# Altium schematic sheet 06-Key.SchDoc
size A4; DocumentNumber: 27; SheetNumber: 27; SheetTotal: 34
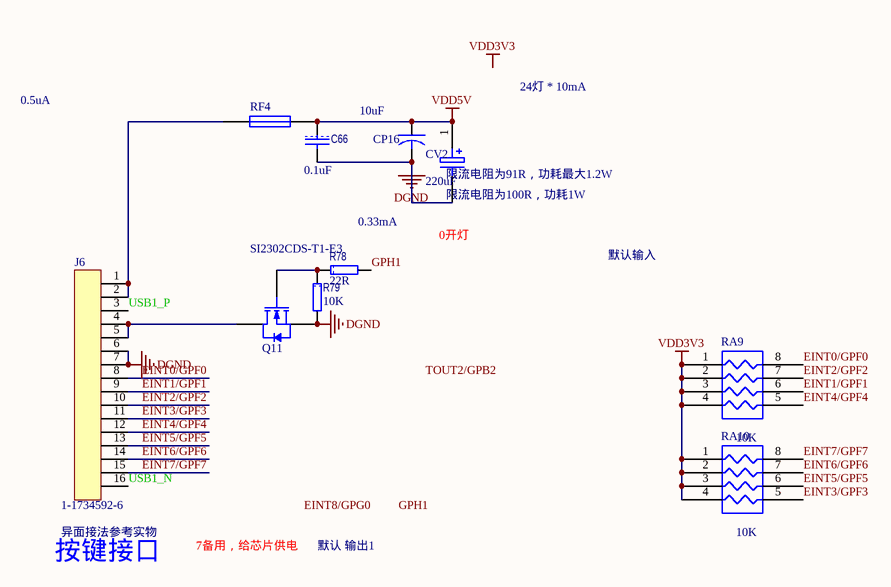
[diagram p0: 06-Key.SchDoc]

## Parts
C66  value 0.1uF  [1608[0603]C]  (hidden comment: C1608X7R1H104K)
CP16  value 10uF  [3216[1206]CB]  (hidden comment: TAJA106K016RNJ)
CV2  value 220uF  [CAPPR5-10x20/H1.1]  (hidden comment: EEU-FM1V221)
J6  1-1734592-6  [FFC/SM0.5-2H16]
Q11  SI2302CDS-T1-E3  [SOT23_N]
R78  value 22R  [1608[0603]R]  (hidden comment: CRCW060322R0FKEA)
R79  value 10K  [1608[0603]R]  (hidden comment: CRCW060310K0FKEA)
RA9  value 10K  [R-AR4]  (hidden comment: CRA06S08310K0JTA)
RA10  value 10K  [R-AR4]  (hidden comment: CRA06S08310K0JTA)
RF4  0805L050WR  [2012[0805]F]  (value not drawn)

## Nets
DGND: C66.2 CP16.2 CV2.2 J6.6 J6.7 Q11.2(S) R79.2
VDD3V3: RA9.1(R1) RA9.2(R2) RA9.3(R3) RA9.4(R4) RA10.1(R1) RA10.2(R2) RA10.3(R3) RA10.4(R4)
VDD5V: C66.1 CP16.1 CV2.1 RF4.2
EINT0/GPF0: J6.8 RA9.8(R1)
EINT1/GPF1: J6.9 RA9.6(R3)
EINT2/GPF2: J6.10 RA9.7(R2)
EINT3/GPF3: J6.11 RA10.5(R4)
EINT4/GPF4: J6.12 RA9.5(R4)
EINT5/GPF5: J6.13 RA10.6(R3)
EINT6/GPF6: J6.14 RA10.7(R2)
EINT7/GPF7: J6.15 RA10.8(R1)
GPH1: R78.2
USB1_N: J6.16
USB1_P: J6.3
NetJ6_1: J6.1 J6.2 RF4.1
NetJ6_4: J6.4 J6.5 Q11.3(D)
NetQ11_1: Q11.1(G) R78.1 R79.1

## Notes on the sheet
- 0.5uA
- 24灯 * 10mA
- (near CV2) 限流电阻为91R，功耗最大1.2W
- (near CV2) 限流电阻为100R，功耗1W
- (near R78) 0.33mA
- 0开灯
- 默认输入
- (near J6) 异面接法参考实物
- 7备用，给芯片供电
- 默认 输出1
- (near J6) 按键接口
- Labels drawn without touching a wire or pin: EINT8/GPG0, GPH1, TOUT2/GPB2, VDD3V3

## Library data of the parts
C66 = CAP: 多层陶瓷电容器MLCC - SMD/SMT 0603 0.1uF 50volts X7R 10%; Manufacturer: TDK; 产品: General Type MLCCs; 产品种类: Low & Medium Capacitance SMD Ceramic Chip Capacitors; 外壳代码 - in: 0603; 外壳代码 - mm: 1608; 封装 / 箱体: 0603 (1608 metric); 封装: Reel; 尺寸: 0.8 mm W x 1.6 mm L x 0.8 mm H; 工作温度范围: - 55 C to + 125 C; 标准包装数量: 4000; 电压额定值: 50 V; 电容-nF: 100 nF; 电容-pF: 100000 pF; 系列: C; Category: 多层陶瓷电容器MLCC - SMD/SMT; ComponentLink1Description: http://www.tdk.com/pdf/general_B11.pdf; ComponentLink1URL: http://www.tdk.com/pdf/general_B11.pdf; Description 1: 多层陶瓷电容器MLCC - SMD/SMT 0603 0.1uF 50volts X7R 10%; Manufacturer Part Number: C1608X7R1H104K; Minimum Order Quantity: 1; Pricing 1: 1=0.160, 50=0.070, 100=0.036, 500=0.019, 1000=0.013, 4000=0.010, 8000=0.009, 12000=0.008, 20000=0.007 (USD); Reeling: True; RoHS - 贸泽: Y; RoHS: RoHS Compliant; Stock 1: 224604; Supplier 1: Mouser; Supplier Part Number 1: 810-C1608X7R1H104K; 制造商: TDK; 容差: 10 %; 温度系数/代码: X7R; 电容: 0.1 uF; 端接类型: SMD/SMT
CP16 = CAPACITOR: 钽质电容器-固体SMD 16volts 10uF 10%; Manufacturer: AVX; ESR: 3 Ohms; 产品: Tantalum Solid Standard Grade - Other Various; 产品种类: SMD Tantalum Capacitors; 制造商库存号: A Case; 外壳代码 - in: 1206; 外壳代码 - mm: 3216; 封装 / 箱体: 1206 (3216 metric); 封装: Reel; 尺寸: 1.6 mm W x 3.2 mm L; 工作温度范围: - 55 C to + 125 C; 损耗因数 DF: 8; 标准包装数量: 2000; 漏泄电流: 1.6 uA; 电压额定值: 16 V; 端接类型: SMD/SMT; 系列: TAJ; 高度: 1.8 mm; Category: 钽质电容器-固体SMD; ComponentLink1Description: http://www.avx.com/docs/Catalogs/taj.pdf; ComponentLink1URL: http://www.avx.com/docs/Catalogs/taj.pdf; Description 1: 钽质电容器-固体SMD 16volts 10uF 10%; Manufacturer Part Number: TAJA106K016RNJ; Minimum Order Quantity: 1; Pricing 1: 1=0.600, 100=0.280, 200=0.250, 500=0.221, 1000=0.200, 2000=0.140, 5000=0.131, 10000=0.124, 25000=0.103 (USD); Reeling: True; RoHS - 贸泽: Y; RoHS: RoHS Compliant; Stock 1: 20335; Supplier 1: Mouser; Supplier Part Number 1: 581-TAJA106K016R; 制造商: AVX; 容差: 10 %; 电容: 10 uF
CV2 = ELECTRO1: 插针 铝质电解电容器 - 带引线 220UF 35V ELECT FM RADIAL; Manufacturer: Panasonic Electronic Components; Manufacturer Part Number: EEU-FM1V471; Description 1: 铝质电解电容器 - 带引线 470UF 35V ELECT FM RADIAL; 电容: 470 uF; 工作温度范围: - 40 C to + 105 C; 封装: Bulk; 产品: General Purpose Electrolytic Capacitors; 容差: 20 %; 外壳直径: 10 mm; 外壳长度: 20 mm; 引线间隔: 5 mm; 制造商: Panasonic; 标准包装数量: 200; Supplier 1: Mouser; Supplier Part Number 1: 667-EEU-FM1V471; RoHS: RoHS Compliant; Category: 铝质电解电容器 - 带引线; Stock 1: 8429; Pricing 1: 1=0.300, 25=0.281, 100=0.258, 250=0.238, 500=0.230, 1000=0.226, 2000=0.216, 5000=0.200 (USD); 系列: FM; 端接类型: Radial; 电压额定值: 35 V; RoHS - 贸泽: Y; Minimum Order Quantity: 1; Reeling: False; ComponentLink1URL: http://www.mouser.com/ds/2/315/ABA0000CE108-5973.pdf; ComponentLink1Description: http://www.mouser.com/ds/2/315/ABA0000CE108-5973.pdf
J6 = 16PIN: TE CONNECTIVITY / AMP - 1-1734592-6 - FFC/FPC CONNECTOR, RECEPTACLE 16POS 1ROW; Pitch Spacing: 0.5; No. of Contacts: 16; No. of Rows: 1; FFC / FPC Thickness: 0.3; Contact Termination: Surface Mount Right Angle; Supplier 1: Newark; Supplier Part Number 1: 16R9533; Manufacturer: TE CONNECTIVITY / AMP; Manufacturer Part Number: 1-1734592-6; RoHS: YES; Description 1: TE CONNECTIVITY / AMP - 1-1734592-6 - FFC/FPC CONNECTOR, RECEPTACLE 16POS 1ROW; Stock 1: 219; Pricing 1: 1=0.383, 25=0.383, 50=0.383, 100=0.328, 500=0.328, 1000=0.328, 2500=0.297 (USD); Series: -; Gender: Receptacle; Contact Plating: Gold; ComponentLink1URL: http://www.tycoelectronics.com/commerce/DocumentDelivery/DDEController?Action=srchrtrv&DocNm=1-1773440-6&DocType=Data+Sheet&DocLang=English; ComponentLink1Description: http://www.tycoelectronics.com/commerce/DocumentDelivery/DDEController?Action=srchrtrv&DocNm=1-1773440-6&DocType=Data+Sheet&DocLang=English; ComponentLink2URL: http://www.farnell.com/cad/1650059.pdf; ComponentLink2Description: http://www.farnell.com/cad/1650059.pdf; ComponentLink3URL: http://www.farnell.com/datasheets/1665333.pdf; ComponentLink3Description: http://www.farnell.com/datasheets/1665333.pdf
Q11 = 2N7002: MOSFET 20V 2.9A 0.86W 57mohm @ 4.5V; Manufacturer: Vishay / Siliconix; 配置: Single; 封装 / 箱体: SOT-23-3; 封装: Reel; 漏极连续电流: 2.6 A; 闸/源击穿电压: +/- 8 V; 安装风格: SMD/SMT; 功率耗散: 710 mW; 电阻汲极/源极 RDS（导通）: 0.057 Ohms; 晶体管极性: N-Channel; 下降时间: 7 ns; 制造商: Vishay; 最大工作温度: + 150 C; 最小工作温度: - 55 C; 产品种类: N-Channel MOSFETs; 标准包装数量: 3000; 典型关闭延迟时间: 30 ns; Supplier 1: Mouser; Supplier Part Number 1: 781-SI2302CDS-E3; Manufacturer Part Number: SI2302CDS-T1-E3; RoHS: RoHS Compliant; Description 1: MOSFET 20V 2.9A 0.86W 57mohm @ 4.5V; Category: MOSFET; Stock 1: 51301; Pricing 1: 1=0.150, 10=0.140, 100=0.130, 250=0.125, 500=0.120, 1000=0.115, 3000=0.110, 6000=0.105, 12000=0.100 (USD); 汲极/源极击穿电压: 20 V; 上升时间: 7 ns; RoHS - 贸泽: Y; Minimum Order Quantity: 1; Reeling: True; ComponentLink1URL: http://www.vishay.com/doc?68645; ComponentLink1Description: http://www.vishay.com/doc?68645
R78 = RES: 厚膜电阻器 - SMD 1/10watt 22ohms 1%; Manufacturer: Vishay / Dale; 尺寸: 0.85 mm W x 1.55 mm L x 0.45 mm H; 工作温度范围: - 55 C to + 155 C; 封装 / 箱体: 0603 (1608 metric); 封装: Reel; 功率额定值: 100 mW; 产品: Thick Film Resistors SMD; 系列: CRCW; 温度系数: 100 PPM / K; 端接类型: SMD/SMT; 电压额定值: 75 V; 制造商: Vishay; 标准包装数量: 5000; 外壳代码 - in: 0603; 外壳代码 - mm: 1608; 产品种类: 0603 Thick Film Chip Resistors; Supplier 1: Mouser; Supplier Part Number 1: 71-CRCW0603-22-E3; Manufacturer Part Number: CRCW060322R0FKEA; RoHS: RoHS Compliant By Exemption; Category: 厚膜电阻器 - SMD; Stock 1: 35802; 电阻: 22 Ohms; 容差: 1 %; Minimum Order Quantity: 1; Reeling: True; ComponentLink1URL: http://www.mouser.com/ds/2/427/dcrcwe3-109170.pdf; ComponentLink1Description: http://www.mouser.com/ds/2/427/dcrcwe3-109170.pdf; Description 1: 厚膜电阻器 - SMD 1/10watt 22ohms 1%; Pricing 1: 1=0.080, 10=0.013, 100=0.010, 1000=0.008, 5000=0.005, 25000=0.004, 50000=0.003 (USD); RoHS - 贸泽: E
R79 = RES: 厚膜电阻器 - SMD 1/10watt 10Kohms 1%; Manufacturer: Vishay / Dale; 尺寸: 0.85 mm W x 1.55 mm L x 0.45 mm H; 工作温度范围: - 55 C to + 155 C; 封装 / 箱体: 0603 (1608 metric); 封装: Reel; 功率额定值: 100 mW; 产品: Thick Film Resistors SMD; 系列: CRCW; 温度系数: 100 PPM / K; 端接类型: SMD/SMT; 电压额定值: 75 V; 制造商: Vishay; 产品种类: 0603 Thick Film Chip Resistors; 标准包装数量: 5000; 外壳代码 - in: 0603; 外壳代码 - mm: 1608; Supplier 1: Mouser; Supplier Part Number 1: 71-CRCW0603-10K-E3; Manufacturer Part Number: CRCW060310K0FKEA; RoHS: RoHS Compliant By Exemption; Category: 厚膜电阻器 - SMD; Stock 1: 0; Pricing 1: 1=0.080, 10=0.013, 100=0.010, 1000=0.008, 5000=0.005, 25000=0.004, 50000=0.003 (USD); 电阻: 10 kOhms; 容差: 1 %; RoHS - 贸泽: E; Minimum Order Quantity: 1; Reeling: True; ComponentLink1URL: http://www.mouser.com/ds/2/427/dcrcwe3-109170.pdf; ComponentLink1Description: http://www.mouser.com/ds/2/427/dcrcwe3-109170.pdf; Description 1: 厚膜电阻器 - SMD 1/10watt 10Kohms 1%
RA9 RA10 = RP4R: 电阻器网络与阵列 8Term 10Kohms 5% Convex; Manufacturer: Vishay / Dale; 尺寸: 1.5 mm W x 1.6 mm L x 0.5 mm H; 工作温度范围: - 55 C to + 150 C; 封装: Reel; 系列: CRA06; 温度系数: 200 PPM / K; 端接类型: SMD/SMT; 电路类型: Isolated; 管脚数量: 8; 电阻器数量: 4; 引线间隔: 0.8 mm; 制造商: Vishay; 产品种类: Thick Film Resistor Arrays; 产品类型: Arrays; Supplier 1: Mouser; Supplier Part Number 1: 71-CRA06S-J-10K; Manufacturer Part Number: CRA06S08310K0JTA; RoHS: RoHS Compliant By Exemption; Description 1: 电阻器网络与阵列 8Term 10Kohms 5% Convex; Category: 电阻器网络与阵列; Stock 1: 11624; Pricing 1: 1=0.090, 100=0.080, 500=0.070, 1000=0.056, 5000=0.051, 10000=0.050, 25000=0.044 (USD); 容差: 5 %; 电阻数值: 10 kOhms; RoHS - 贸泽: E; Minimum Order Quantity: 1; Reeling: True; ComponentLink1URL: http://www.mouser.com/ds/2/427/cra06es-73101.pdf; ComponentLink1Description: http://www.mouser.com/ds/2/427/cra06es-73101.pdf
RF4 = FUSE1: 可复位保险丝 PTC 30V POLY SURF MOUNT 0805.500A; Manufacturer: Littelfuse; Resistance: 850 mOhms; Current Rating (Max): 100 A; Hold Current: 0.5 A; Maximum Voltage: 6 VDC; Trip Current: 1 A; Supplier 1: Mouser; Supplier Part Number 1: 576-0805L050; Manufacturer Part Number: 0805L050WR; RoHS: RoHS Compliant; Category: Resettable Fuses - PPTC; Stock 1: 4103; Pricing 1: 1=3.25, 10=2.61, 50=2.39, 100=2.12, 200=2.07, 500=1.74, 1000=1.49, 3000=1.40, 6000=1.35 (AUD); Dimensions: 2.2 mm L x 1.5 mm W x 1.25 mm  H; Operating Temperature Range: - 40 C to + 85 C; Package / Case: 0805 (2012 metric); Packaging: Reel; Series: 0805L; Termination Style: SMD/SMT; Type: PolyFuse Resettable PTC; Mounting Style: SMD/SMT; Product Category: Resettable PTCs; Standard Pack Qty: 3000; RoHS - Mouser: Y; Minimum Order Quantity: 1; Reeling: True; ComponentLink1URL: http://www.mouser.com/ds/2/240/Littelfuse_0805L-32472.pdf; ComponentLink1Description: http://www.mouser.com/ds/2/240/Littelfuse_0805L-32472.pdf